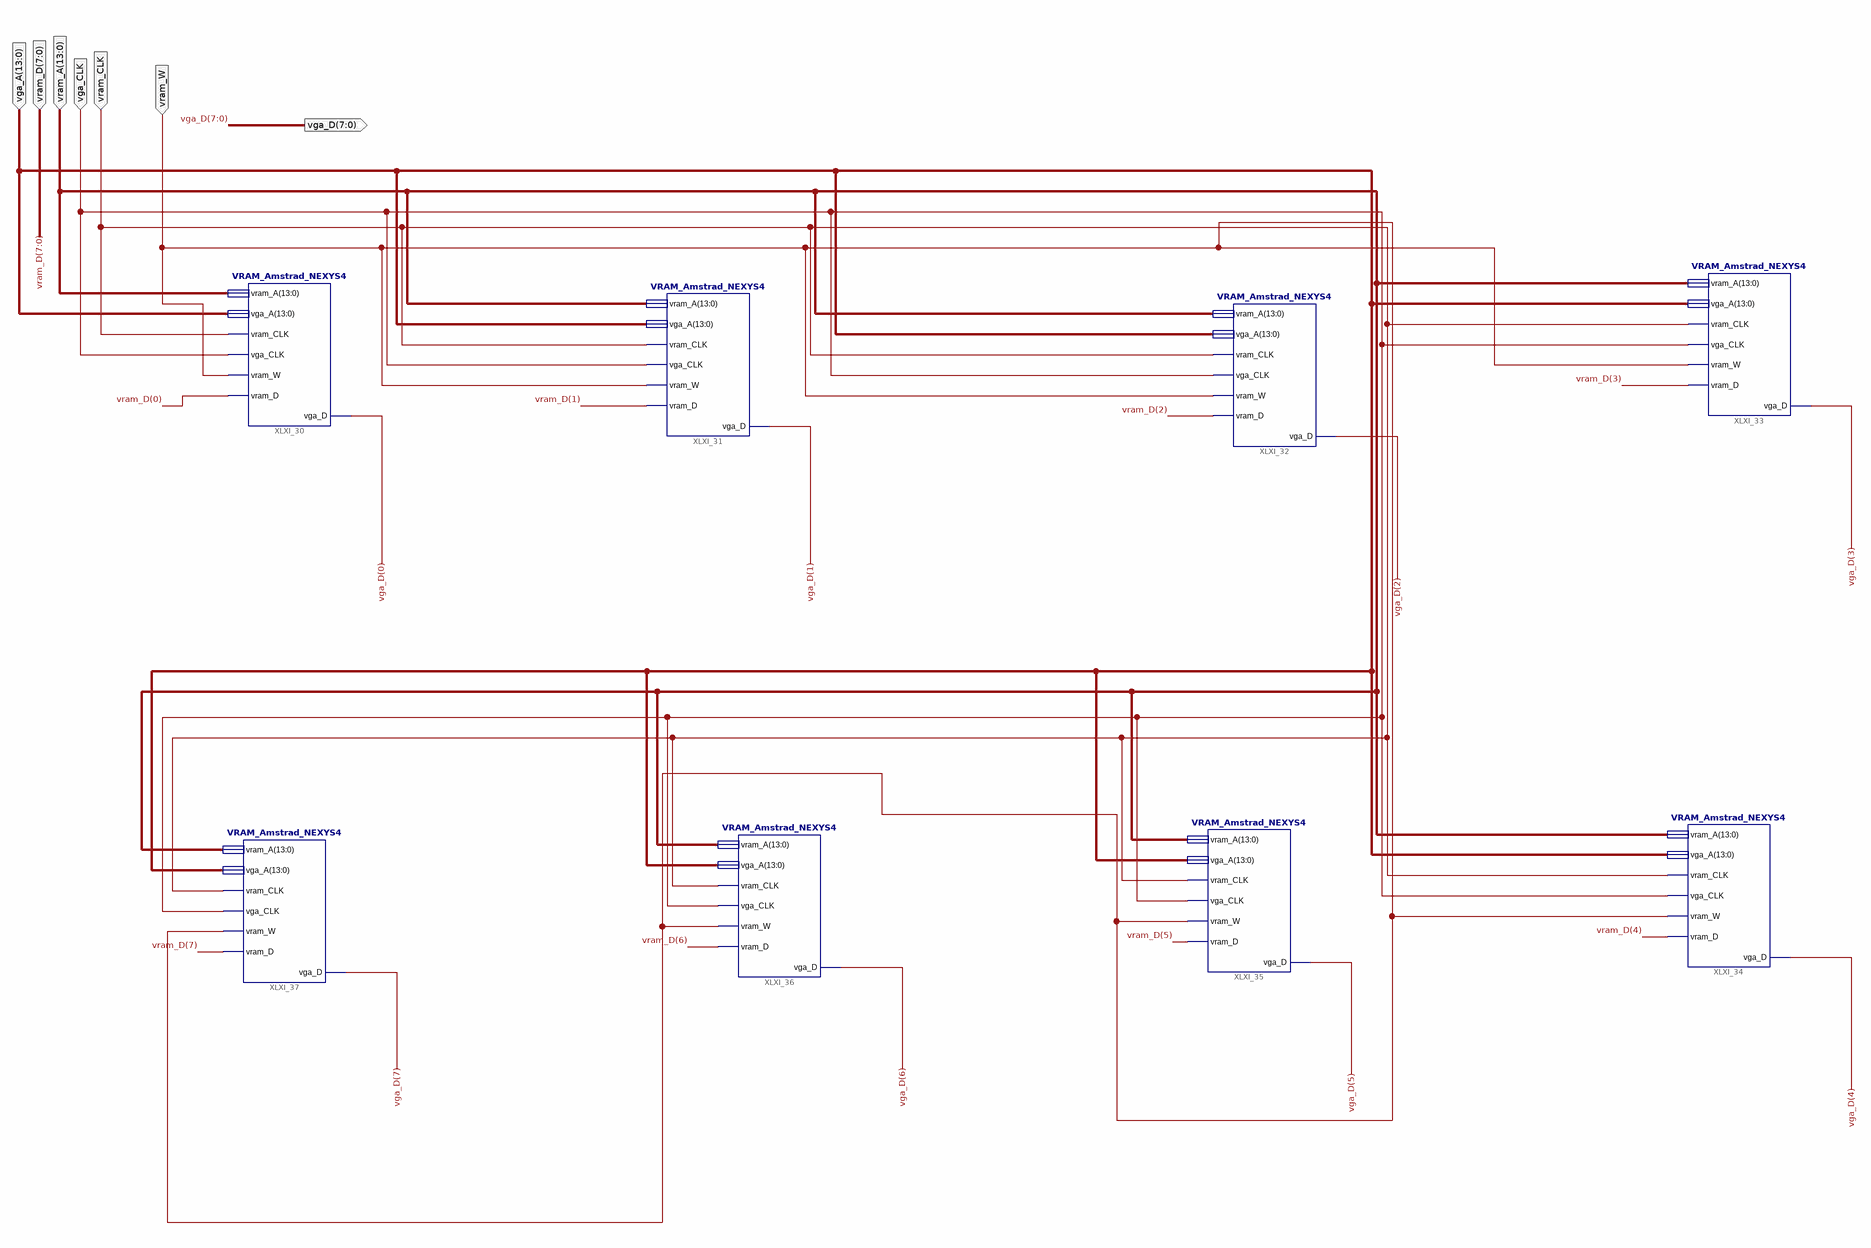
[diagram p0: schematic sheet 1]
// Xilinx ISE schematic VRAM_Amstrad_NEXYS4_16Ko.sch (artix7) as structural Verilog: 8 symbols, 7 ports
module VRAM_Amstrad_NEXYS4_16Ko (
  input  vram_CLK,
  input  vga_CLK,
  input  [13:0] vram_A,
  input  [13:0] vga_A,
  input  vram_W,
  input  [7:0] vram_D,
  output [7:0] vga_D
);

  VRAM_Amstrad_NEXYS4 XLXI_30 (
    .vram_A(vram_A), .vga_A(vga_A), .vram_CLK(vram_CLK), .vga_CLK(vga_CLK), .vram_W(vram_W),
    .vram_D(vram_D[0]), .vga_D(vga_D[0]));
  VRAM_Amstrad_NEXYS4 XLXI_31 (
    .vram_A(vram_A), .vga_A(vga_A), .vram_CLK(vram_CLK), .vga_CLK(vga_CLK), .vram_W(vram_W),
    .vram_D(vram_D[1]), .vga_D(vga_D[1]));
  VRAM_Amstrad_NEXYS4 XLXI_32 (
    .vram_A(vram_A), .vga_A(vga_A), .vram_CLK(vram_CLK), .vga_CLK(vga_CLK), .vram_W(vram_W),
    .vram_D(vram_D[2]), .vga_D(vga_D[2]));
  VRAM_Amstrad_NEXYS4 XLXI_33 (
    .vram_A(vram_A), .vga_A(vga_A), .vram_CLK(vram_CLK), .vga_CLK(vga_CLK), .vram_W(vram_W),
    .vram_D(vram_D[3]), .vga_D(vga_D[3]));
  VRAM_Amstrad_NEXYS4 XLXI_34 (
    .vram_A(vram_A), .vga_A(vga_A), .vram_CLK(vram_CLK), .vga_CLK(vga_CLK), .vram_W(vram_W),
    .vram_D(vram_D[4]), .vga_D(vga_D[4]));
  VRAM_Amstrad_NEXYS4 XLXI_35 (
    .vram_A(vram_A), .vga_A(vga_A), .vram_CLK(vram_CLK), .vga_CLK(vga_CLK), .vram_W(vram_W),
    .vram_D(vram_D[5]), .vga_D(vga_D[5]));
  VRAM_Amstrad_NEXYS4 XLXI_36 (
    .vram_A(vram_A), .vga_A(vga_A), .vram_CLK(vram_CLK), .vga_CLK(vga_CLK), .vram_W(vram_W),
    .vram_D(vram_D[6]), .vga_D(vga_D[6]));
  VRAM_Amstrad_NEXYS4 XLXI_37 (
    .vram_A(vram_A), .vga_A(vga_A), .vram_CLK(vram_CLK), .vga_CLK(vga_CLK), .vram_W(vram_W),
    .vram_D(vram_D[7]), .vga_D(vga_D[7]));
endmodule
